# EAGLE schematic fmcboard_v1.61 (EAGLE 9.6.2)

## Sheet 1 of 4: Power, IO, Arduino
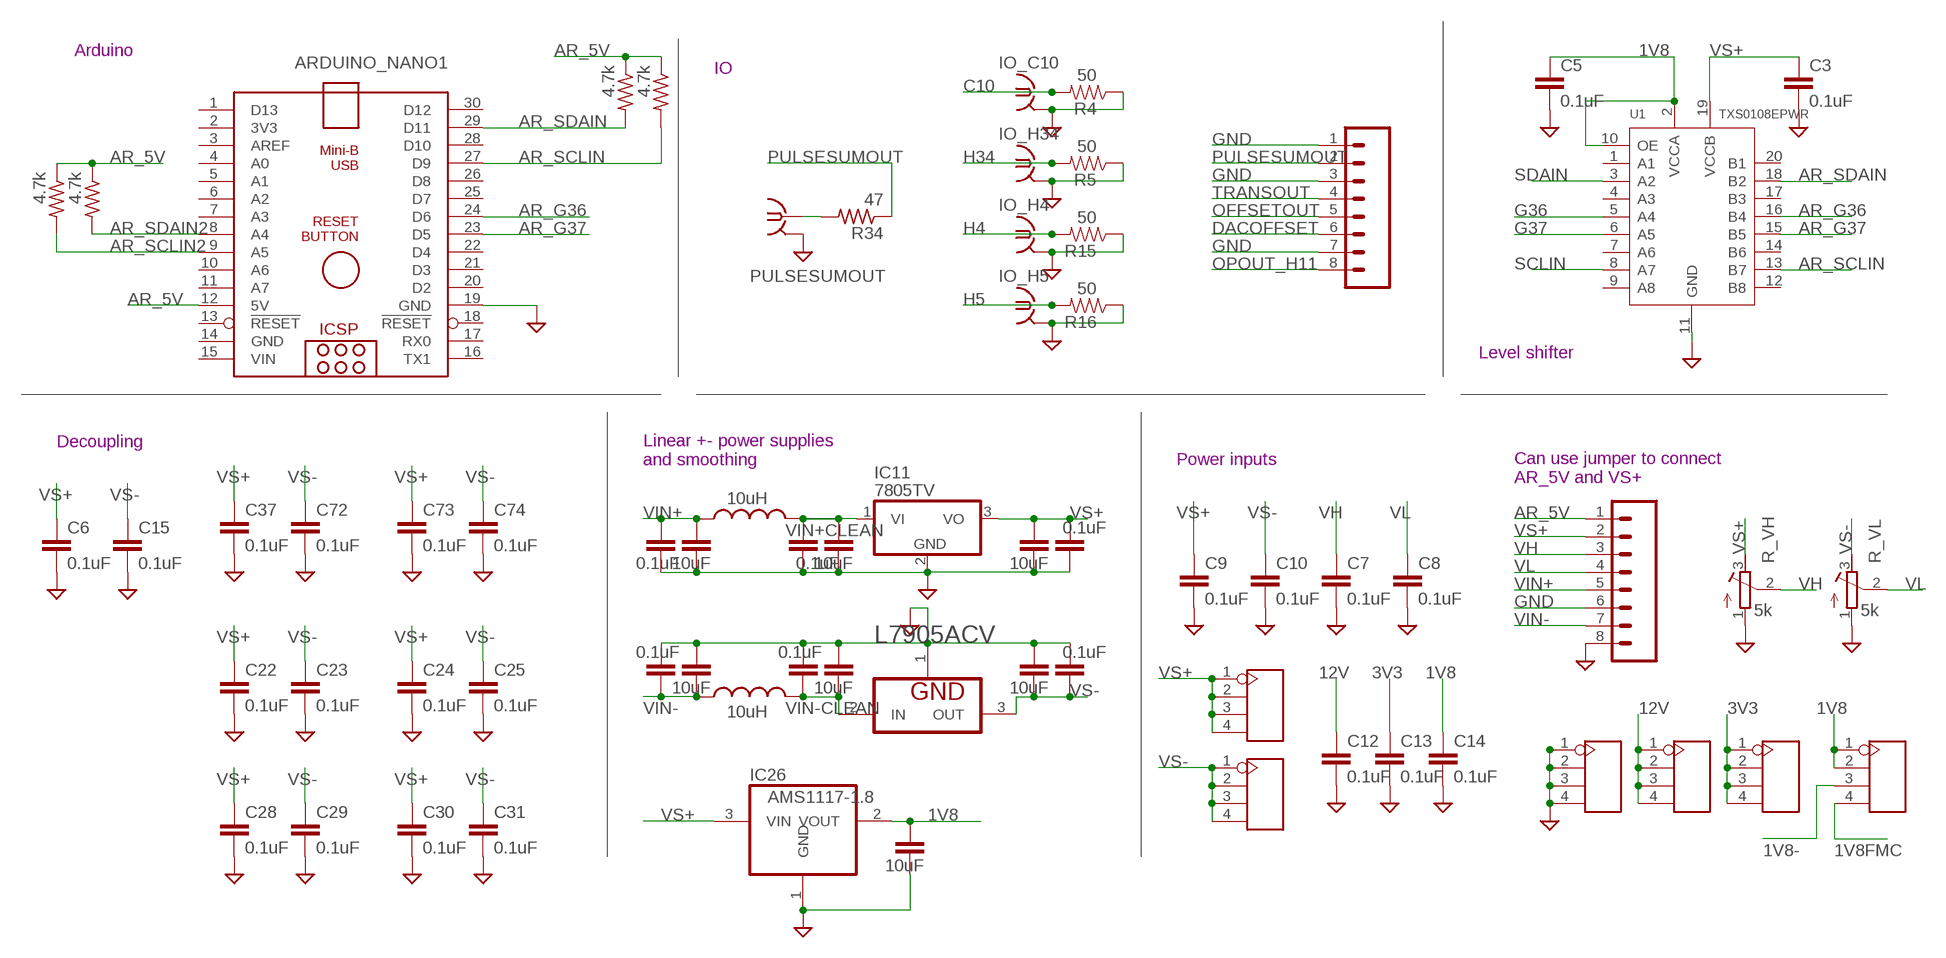
[diagram p0: schematic, sheet 1]

### Parts
ARDUINO_NANO1  1  ARDUINO_NANO  [ARDUINO_NANO]
C1  10uF  CAP0805  [0805]
C2  10uF  CAP0805  [0805]
C3  0.1uF  CAP0805  [0805]
C5  0.1uF  CAP0805  [0805]
C6  0.1uF  CAP0805  [0805]
C7  0.1uF  CAP0805  [0805]
C8  0.1uF  CAP0805  [0805]
C9  0.1uF  CAP0805  [0805]
C10  0.1uF  CAP0805  [0805]
C12  0.1uF  CAP0805  [0805]
C13  0.1uF  CAP0805  [0805]
C14  0.1uF  CAP0805  [0805]
C15  0.1uF  CAP0805  [0805]
C22  0.1uF  CAP0805  [0805]
C23  0.1uF  CAP0805  [0805]
C24  0.1uF  CAP0805  [0805]
C25  0.1uF  CAP0805  [0805]
C28  0.1uF  CAP0805  [0805]
C29  0.1uF  CAP0805  [0805]
C30  0.1uF  CAP0805  [0805]
C31  0.1uF  CAP0805  [0805]
C34  10uF  CAP0805  [0805]
C37  0.1uF  CAP0805  [0805]
C38  10uF  CAP0805  [0805]
C39  10uF  CAP0805  [0805]
C40  10uF  CAP0805  [0805]
C41  10uF  CAP0805  [0805]
C42  0.1uF  CAP0805  [0805]
C43  0.1uF  CAP0805  [0805]
C44  0.1uF  CAP0805  [0805]
C45  0.1uF  CAP0805  [0805]
C46  0.1uF  CAP0805  [0805]
C47  0.1uF  CAP0805  [0805]
C72  0.1uF  CAP0805  [0805]
C73  0.1uF  CAP0805  [0805]
C74  0.1uF  CAP0805  [0805]
IC11  7805TV  [TO220V]
IC26  AMS1117-1.8  REG1117  [SOT223]
IO_C10  BU-SMB-V  [BU-SMB-V]
IO_H4  BU-SMB-V  [BU-SMB-V]
IO_H5  BU-SMB-V  [BU-SMB-V]
IO_H34  BU-SMB-V  [BU-SMB-V]
J1  8pin  CONN_08"  [1X08]
J3  4p-2.54  DIP-BLACK-FEMALE-HEADER-VERT(4P-2.54)  [H4-2.54]
J4  4p-2.54  DIP-BLACK-FEMALE-HEADER-VERT(4P-2.54)  [H4-2.54]
J5  8pin  CONN_08"  [1X08]
J6  4p-2.54  DIP-BLACK-FEMALE-HEADER-VERT(4P-2.54)  [H4-2.54]
J7  4p-2.54  DIP-BLACK-FEMALE-HEADER-VERT(4P-2.54)  [H4-2.54]
J8  4p-2.54  DIP-BLACK-FEMALE-HEADER-VERT(4P-2.54)  [H4-2.54]
J12  4p-2.54  DIP-BLACK-FEMALE-HEADER-VERT(4P-2.54)  [H4-2.54]
L1  10uH  INDUCTOR1210  [1210]
L2  10uH  INDUCTOR1210  [1210]
PULSESUMOUT  BU-SMB-V  [BU-SMB-V]
R4  50  RESISTORAXIAL-0.3  [AXIAL-0.3]
R5  50  RESISTORAXIAL-0.3  [AXIAL-0.3]
R15  50  RESISTORAXIAL-0.3  [AXIAL-0.3]
R16  50  RESISTORAXIAL-0.3  [AXIAL-0.3]
R34  47  R-US_R0805  [R0805]
R48  4.7k  R-US_R0805  [R0805]
R49  4.7k  R-US_R0805  [R0805]
R50  4.7k  R-US_R0805  [R0805]
R51  4.7k  R-US_R0805  [R0805]
R_VH  5k  R-TRIMM3296W  [RTRIM3296W]
R_VL  5k  R-TRIMM3296W  [RTRIM3296W]
U1  TXS0108EPWR  LOGIC-TXS0108EPWR(TSSOP20)  [TSSOP20-0.65-6.5X4.4MM]
U2  STMICROELECTRONICS_L7905ACVSTMICROELECTRONICS_L7905ACV_0_0  [STMICROELECTRONICS_L7905ACV_0]

### Nets
1V8 [power]: C5.1 C14.1 C34.1 IC26.2(VOUT) J12.1 J12.2 U1.2(VCCA) U1.10(OE) ; also sheet 2,3
1V8-: J12.3 ; also sheet 2,3
1V8FMC [power]: J12.4 ; also sheet 4
3V3 [power]: C13.1 J3.1 J3.2 J3.3 J3.4 ; also sheet 4
12V [power]: C12.1 J8.1 J8.2 J8.3 J8.4 ; also sheet 4
AR_5V [power]: ARDUINO_NANO1.12(5V) J1.1 R48.1 R49.1 R50.1 R51.1
AR_G36: ARDUINO_NANO1.24(D6) U1.16(B4)
AR_G37: ARDUINO_NANO1.23(D5) U1.15(B5)
AR_SCLIN: ARDUINO_NANO1.27(D9) R51.2 U1.13(B7)
AR_SCLIN2: ARDUINO_NANO1.9(A5) R49.2 ; also sheet 2
AR_SDAIN: ARDUINO_NANO1.29(D11) R50.2 U1.18(B2)
AR_SDAIN2: ARDUINO_NANO1.8(A4) R48.2 ; also sheet 2
C10: IO_C10.1 R4.P$2 ; also sheet 2,4
DACOFFSET: J5.6 ; also sheet 2,3
G36: U1.5(A4) ; also sheet 4
G37: U1.6(A5) ; also sheet 4
GND [gnd]: ARDUINO_NANO1.19(GND) C1.2 C2.2 C3.2 C5.2 C6.2 C7.2 C8.2 C9.2 C10.2 C12.2 C13.2 C14.2 C15.2 C22.2 C23.2 C24.2 C25.2 C28.2 C29.2 C30.2 C31.2 C34.2 C37.2 C38.2 C39.1 C40.1 C41.1 C42.2 C43.2 C44.1 C45.1 C46.1 C47.2 C72.2 C73.2 C74.2 IC11.2(GND) IC26.1(GND) IO_C10.2 IO_C10.3 IO_C10.4 IO_C10.5 IO_H4.2 IO_H4.3 IO_H4.4 IO_H4.5 IO_H5.2 IO_H5.3 IO_H5.4 IO_H5.5 IO_H34.2 IO_H34.3 IO_H34.4 IO_H34.5 J1.6 J1.8 J4.1 J4.2 J4.3 J4.4 J5.1 J5.3 J5.7 PULSESUMOUT.2 PULSESUMOUT.3 PULSESUMOUT.4 PULSESUMOUT.5 R4.P$1 R5.P$1 R15.P$1 R16.P$1 R_VH.1(A) R_VL.1(A) U1.11(GND) U2.1(GND) ; also sheet 2,3,4
H4: IO_H4.1 R15.P$2 ; also sheet 4
H5: IO_H5.1 R16.P$2 ; also sheet 4
H34: IO_H34.1 R5.P$2 ; also sheet 2,4
N$18: PULSESUMOUT.1 R34.2
OFFSETOUT: J5.5 ; also sheet 3
OPOUT_H11: J5.8 ; also sheet 3,4
PULSESUMOUT: J5.2 R34.1 ; also sheet 3
SCLIN: U1.8(A7) ; also sheet 4
SDAIN: U1.3(A2) ; also sheet 4
TRANSOUT: J5.4 ; also sheet 3
VH: C7.1 J1.3 R_VH.2(S) ; also sheet 3
VIN+ [power]: C1.1 C42.1 J1.5 L1.1
VIN+CLEAN [power]: C2.1 C43.1 IC11.1(VI) L1.2
VIN- [power]: C41.2 C44.2 J1.7 L2.1
VIN-CLEAN [power]: C40.2 C45.2 L2.2 U2.2(IN)
VL: C8.1 J1.4 R_VL.2(S) ; also sheet 3
VS+ [power]: C3.1 C6.1 C9.1 C22.1 C24.1 C28.1 C30.1 C37.1 C38.1 C47.1 C73.1 IC11.3(VO) IC26.3(VIN) J1.2 J6.1 J6.2 J6.3 J6.4 R_VH.3(E) U1.19(VCCB) ; also sheet 2,3
VS- [power]: C10.1 C15.1 C23.1 C25.1 C29.1 C31.1 C39.2 C46.2 C72.1 C74.1 J7.1 J7.2 J7.3 J7.4 R_VL.3(E) U2.3(OUT) ; also sheet 2,3
Unconnected: ARDUINO_NANO1.1(D13) ARDUINO_NANO1.2(3V3) ARDUINO_NANO1.3(AREF) ARDUINO_NANO1.4(A0) ARDUINO_NANO1.5(A1) ARDUINO_NANO1.6(A2) ARDUINO_NANO1.7(A3) ARDUINO_NANO1.10(A6) ARDUINO_NANO1.11(A7) ARDUINO_NANO1.13(!RESET) ARDUINO_NANO1.16(TX1) ARDUINO_NANO1.17(RX0) ARDUINO_NANO1.18(!RESET) ARDUINO_NANO1.20(D2) ARDUINO_NANO1.21(D3) ARDUINO_NANO1.22(D4) ARDUINO_NANO1.25(D7) ARDUINO_NANO1.26(D8) ARDUINO_NANO1.28(D10) ARDUINO_NANO1.30(D12) U1.1(A1) U1.4(A3) U1.7(A6) U1.9(A8) U1.12(B8) U1.14(B6) U1.17(B3) U1.20(B1)

### Notes on the sheet
- Arduino
- IO
- Level shifter
- Decoupling
- Linear +- power supplies
  and smoothing
- Power inputs
- Can use jumper to connect 
  AR_5V and VS+

## Sheet 2 of 4: Pulse generator
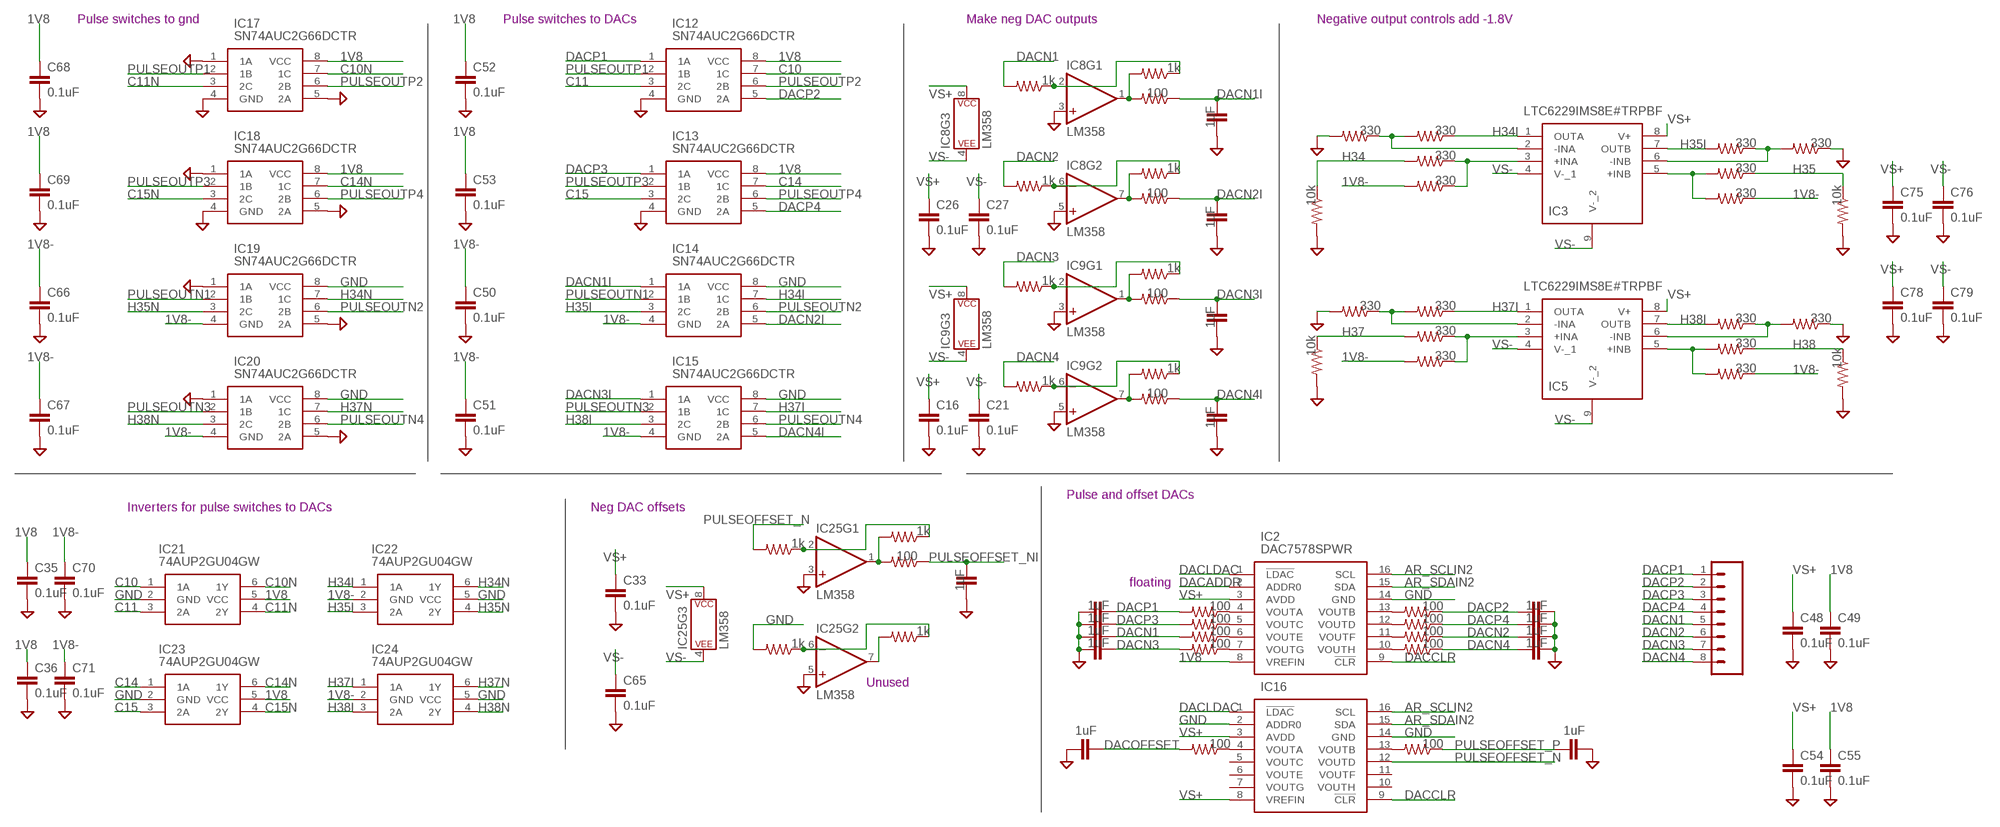
[diagram p1: schematic, sheet 2]

### Parts
C11  1uF  CAP0805  [0805]
C16  0.1uF  CAP0805  [0805]
C17  1uF  CAP0805  [0805]
C18  1uF  CAP0805  [0805]
C19  1uF  CAP0805  [0805]
C20  1uF  CAP0805  [0805]
C21  0.1uF  CAP0805  [0805]
C26  0.1uF  CAP0805  [0805]
C27  0.1uF  CAP0805  [0805]
C33  0.1uF  CAP0805  [0805]
C35  0.1uF  CAP0805  [0805]
C36  0.1uF  CAP0805  [0805]
C48  0.1uF  CAP0805  [0805]
C49  0.1uF  CAP0805  [0805]
C50  0.1uF  CAP0805  [0805]
C51  0.1uF  CAP0805  [0805]
C52  0.1uF  CAP0805  [0805]
C53  0.1uF  CAP0805  [0805]
C54  0.1uF  CAP0805  [0805]
C55  0.1uF  CAP0805  [0805]
C56  1uF  CAP0805  [0805]
C57  1uF  CAP0805  [0805]
C58  1uF  CAP0805  [0805]
C59  1uF  CAP0805  [0805]
C60  1uF  CAP0805  [0805]
C61  1uF  CAP0805  [0805]
C62  1uF  CAP0805  [0805]
C63  1uF  CAP0805  [0805]
C64  1uF  CAP0805  [0805]
C65  0.1uF  CAP0805  [0805]
C66  0.1uF  CAP0805  [0805]
C67  0.1uF  CAP0805  [0805]
C68  0.1uF  CAP0805  [0805]
C69  0.1uF  CAP0805  [0805]
C70  0.1uF  CAP0805  [0805]
C71  0.1uF  CAP0805  [0805]
C75  0.1uF  CAP0805  [0805]
C76  0.1uF  CAP0805  [0805]
C78  0.1uF  CAP0805  [0805]
C79  0.1uF  CAP0805  [0805]
C80  1uF  CAP0805  [0805]
IC2  DAC7578SPWR  [SOP65P640X120-16N]
IC3  LTC6229IMS8E#TRPBF  [SOP65P490X110-9N]
IC5  LTC6229IMS8E#TRPBF  [SOP65P490X110-9N]
IC8  LM358  OPAMP-DUALU  [SO08]
IC9  LM358  OPAMP-DUALU  [SO08]
IC12  SN74AUC2G66DCTR  [SOP65P400X130-8N]
IC13  SN74AUC2G66DCTR  [SOP65P400X130-8N]
IC14  SN74AUC2G66DCTR  [SOP65P400X130-8N]
IC15  SN74AUC2G66DCTR  [SOP65P400X130-8N]
IC16  DAC7578SPWR  [SOP65P640X120-16N]
IC17  SN74AUC2G66DCTR  [SOP65P400X130-8N]
IC18  SN74AUC2G66DCTR  [SOP65P400X130-8N]
IC19  SN74AUC2G66DCTR  [SOP65P400X130-8N]
IC20  SN74AUC2G66DCTR  [SOP65P400X130-8N]
IC21  74AUP2GU04GW  74AUP2GU04GW,125  [SOT65P210X110-6N]
IC22  74AUP2GU04GW  74AUP2GU04GW,125  [SOT65P210X110-6N]
IC23  74AUP2GU04GW  74AUP2GU04GW,125  [SOT65P210X110-6N]
IC24  74AUP2GU04GW  74AUP2GU04GW,125  [SOT65P210X110-6N]
IC25  LM358  OPAMP-DUALU  [SO08]
J9  8pin  CONN_08"  [1X08]
R14  1k  R-US_R0805  [R0805]
R21  330  R-US_R0805  [R0805]
R22  330  R-US_R0805  [R0805]
R23  330  R-US_R0805  [R0805]
R24  330  R-US_R0805  [R0805]
R27  330  R-US_R0805  [R0805]
R28  330  R-US_R0805  [R0805]
R29  330  R-US_R0805  [R0805]
R30  330  R-US_R0805  [R0805]
R35  1k  R-US_R0805  [R0805]
R37  330  R-US_R0805  [R0805]
R39  330  R-US_R0805  [R0805]
R41  330  R-US_R0805  [R0805]
R43  330  R-US_R0805  [R0805]
R44  330  R-US_R0805  [R0805]
R45  330  R-US_R0805  [R0805]
R46  330  R-US_R0805  [R0805]
R47  100  R-US_R0805  [R0805]
R52  330  R-US_R0805  [R0805]
R53  100  R-US_R0805  [R0805]
R54  100  R-US_R0805  [R0805]
R55  100  R-US_R0805  [R0805]
R56  100  R-US_R0805  [R0805]
R57  100  R-US_R0805  [R0805]
R58  100  R-US_R0805  [R0805]
R59  100  R-US_R0805  [R0805]
R60  100  R-US_R0805  [R0805]
R61  1k  R-US_R0805  [R0805]
R62  1k  R-US_R0805  [R0805]
R63  1k  R-US_R0805  [R0805]
R64  1k  R-US_R0805  [R0805]
R65  1k  R-US_R0805  [R0805]
R66  1k  R-US_R0805  [R0805]
R67  1k  R-US_R0805  [R0805]
R68  1k  R-US_R0805  [R0805]
R69  1k  R-US_R0805  [R0805]
R70  1k  R-US_R0805  [R0805]
R73  100  R-US_R0805  [R0805]
R74  100  R-US_R0805  [R0805]
R75  100  R-US_R0805  [R0805]
R76  100  R-US_R0805  [R0805]
R77  100  R-US_R0805  [R0805]
R80  10k  R-US_R0805  [R0805]
R81  10k  R-US_R0805  [R0805]
R82  10k  R-US_R0805  [R0805]
R83  10k  R-US_R0805  [R0805]
R84  100  R-US_R0805  [R0805]

### Nets
1V8 [power]: C35.1 C36.1 C49.1 C52.1 C53.1 C55.1 C68.1 C69.1 IC2.8(VREFIN) IC12.8(VCC) IC13.8(VCC) IC17.8(VCC) IC18.8(VCC) IC21.5(VCC) IC23.5(VCC) ; also sheet 1,3
1V8-: C50.1 C51.1 C66.1 C67.1 C70.1 C71.1 IC14.4(GND) IC15.4(GND) IC19.4(GND) IC20.4(GND) IC22.2(GND) IC24.2(GND) R22.2 R28.1 R39.2 R45.1 ; also sheet 1,3
AR_SCLIN2: IC2.16(SCL) IC16.16(SCL) ; also sheet 1
AR_SDAIN2: IC2.15(SDA) IC16.15(SDA) ; also sheet 1
C10: IC12.7(1C) IC21.1(1A) ; also sheet 1,4
C10N: IC17.7(1C) IC21.6(1Y)
C11: IC12.3(2C) IC21.3(2A) ; also sheet 4
C11N: IC17.3(2C) IC21.4(2Y)
C14: IC13.7(1C) IC23.1(1A) ; also sheet 4
C14N: IC18.7(1C) IC23.6(1Y)
C15: IC13.3(2C) IC23.3(2A) ; also sheet 4
C15N: IC18.3(2C) IC23.4(2Y)
DACADDR: IC2.2(ADDR0)
DACCLR: IC2.9(!CLR) IC16.9(!CLR)
DACLDAC: IC2.1(!LDAC) IC16.1(!LDAC)
DACN1: C57.2 J9.5 R54.2 R64.2
DACN1I: C17.2 IC14.1(1A) R74.1
DACN2: C61.1 J9.6 R58.1 R65.2
DACN2I: C18.2 IC14.5(2A) R75.1
DACN3: C56.2 J9.7 R55.2 R68.2
DACN3I: C19.2 IC15.1(1A) R76.1
DACN4: C60.1 J9.8 R59.1 R69.2
DACN4I: C20.2 IC15.5(2A) R77.1
DACOFFSET: C64.2 R60.2 ; also sheet 1,3
DACP1: C59.2 IC12.1(1A) J9.1 R47.2
DACP2: C63.1 IC12.5(2A) J9.2 R56.1
DACP3: C58.2 IC13.1(1A) J9.3 R53.2
DACP4: C62.1 IC13.5(2A) J9.4 R57.1
GND [gnd]: C11.1 C16.2 C17.1 C18.1 C19.1 C20.1 C21.2 C26.2 C27.2 C33.2 C35.2 C36.2 C48.2 C49.2 C50.2 C51.2 C52.2 C53.2 C54.2 C55.2 C56.1 C57.1 C58.1 C59.1 C60.2 C61.2 C62.2 C63.2 C64.1 C65.2 C66.2 C67.2 C68.2 C69.2 C70.2 C71.2 C75.2 C76.2 C78.2 C79.2 C80.2 IC2.14(GND) IC8.3(+IN) IC8.5(+IN) IC9.3(+IN) IC9.5(+IN) IC12.4(GND) IC13.4(GND) IC14.8(VCC) IC15.8(VCC) IC16.2(ADDR0) IC16.14(GND) IC17.1(1A) IC17.4(GND) IC17.5(2A) IC18.1(1A) IC18.4(GND) IC18.5(2A) IC19.1(1A) IC19.5(2A) IC19.8(VCC) IC20.1(1A) IC20.5(2A) IC20.8(VCC) IC21.2(GND) IC22.5(VCC) IC23.2(GND) IC24.5(VCC) IC25.3(+IN) IC25.5(+IN) R24.2 R30.1 R43.2 R52.1 R70.2 R80.2 R81.2 R82.2 R83.2 ; also sheet 1,3,4
H34: R21.2 R80.1 ; also sheet 1,4
H34I: IC3.1(OUTA) IC14.7(1C) IC22.1(1A) R23.1
H34N: IC19.7(1C) IC22.6(1Y)
H35: R27.1 R81.1 ; also sheet 4
H35I: IC3.7(OUTB) IC14.3(2C) IC22.3(2A) R29.2
H35N: IC19.3(2C) IC22.4(2Y)
H37: R37.2 R83.1 ; also sheet 4
H37I: IC5.1(OUTA) IC15.7(1C) IC24.1(1A) R41.1
H37N: IC20.7(1C) IC24.6(1Y)
H38: R44.1 R82.1 ; also sheet 4
H38I: IC5.7(OUTB) IC15.3(2C) IC24.3(2A) R46.2
H38N: IC20.3(2C) IC24.4(2Y)
N$4: IC3.6(-INB) R29.1 R30.2
N$5: IC3.5(+INB) R27.2 R28.2
N$6: IC5.2(-INA) R41.2 R43.1
N$7: IC3.3(+INA) R21.1 R22.1
N$12: IC5.6(-INB) R46.1 R52.2
N$13: IC3.2(-INA) R23.2 R24.1
N$14: IC5.3(+INA) R37.1 R39.1
N$15: IC5.5(+INB) R44.2 R45.2
N$16: IC8.7(OUT) R62.2 R75.2
N$17: IC8.1(OUT) R63.2 R74.2
N$19: IC8.2(-IN) R63.1 R64.1
N$20: IC8.6(-IN) R62.1 R65.1
N$21: IC2.13(VOUTB) R56.2
N$22: IC2.4(VOUTA) R47.1
N$23: IC2.5(VOUTC) R53.1
N$24: IC2.6(VOUTE) R54.1
N$25: IC2.7(VOUTG) R55.1
N$26: IC2.12(VOUTD) R57.2
N$27: IC2.11(VOUTF) R58.2
N$28: IC2.10(VOUTH) R59.2
N$29: IC16.4(VOUTA) R60.1
N$30: IC25.7(OUT) R14.2
N$31: IC9.7(OUT) R66.2 R77.2
N$32: IC9.1(OUT) R67.2 R76.2
N$33: IC9.2(-IN) R67.1 R68.1
N$34: IC9.6(-IN) R66.1 R69.1
N$36: IC25.1(OUT) R35.2 R73.2
N$37: IC25.2(-IN) R35.1 R61.1
N$38: IC25.6(-IN) R14.1 R70.1
N$39: IC16.13(VOUTB) R84.2
PULSEOFFSET_N: IC16.12(VOUTD) R61.2
PULSEOFFSET_NI: C11.2 R73.1 ; also sheet 3
PULSEOFFSET_P: C80.1 R84.1 ; also sheet 3
PULSEOUTN1: IC14.2(1B) IC19.2(1B) ; also sheet 3
PULSEOUTN2: IC14.6(2B) IC19.6(2B) ; also sheet 3
PULSEOUTN3: IC15.2(1B) IC20.2(1B) ; also sheet 3
PULSEOUTN4: IC15.6(2B) IC20.6(2B) ; also sheet 3
PULSEOUTP1: IC12.2(1B) IC17.2(1B) ; also sheet 3
PULSEOUTP2: IC12.6(2B) IC17.6(2B) ; also sheet 3
PULSEOUTP3: IC13.2(1B) IC18.2(1B) ; also sheet 3
PULSEOUTP4: IC13.6(2B) IC18.6(2B) ; also sheet 3
VS+ [power]: C16.1 C26.1 C33.1 C48.1 C54.1 C75.1 C78.1 IC2.3(AVDD) IC3.8(V+) IC5.8(V+) IC8.8(P$V+) IC9.8(P$V+) IC16.3(AVDD) IC16.8(VREFIN) IC25.8(P$V+) ; also sheet 1,3
VS- [power]: C21.1 C27.1 C65.1 C76.1 C79.1 IC3.4(V-_1) IC3.9(V-_2) IC5.4(V-_1) IC5.9(V-_2) IC8.4(P$V-) IC9.4(P$V-) IC25.4(P$V-) ; also sheet 1,3
Unconnected: IC16.5(VOUTC) IC16.6(VOUTE) IC16.7(VOUTG) IC16.10(VOUTH) IC16.11(VOUTF)

### Notes on the sheet
- Pulse switches to gnd | Pulse switches to DACs | Make neg DAC outputs | Negative output controls add -1.8V
- Pulse and offset DACs
- Inverters for pulse switches to DACs | Neg DAC offsets
- floating
- Unused

## Sheet 3 of 4: Input amplifiers
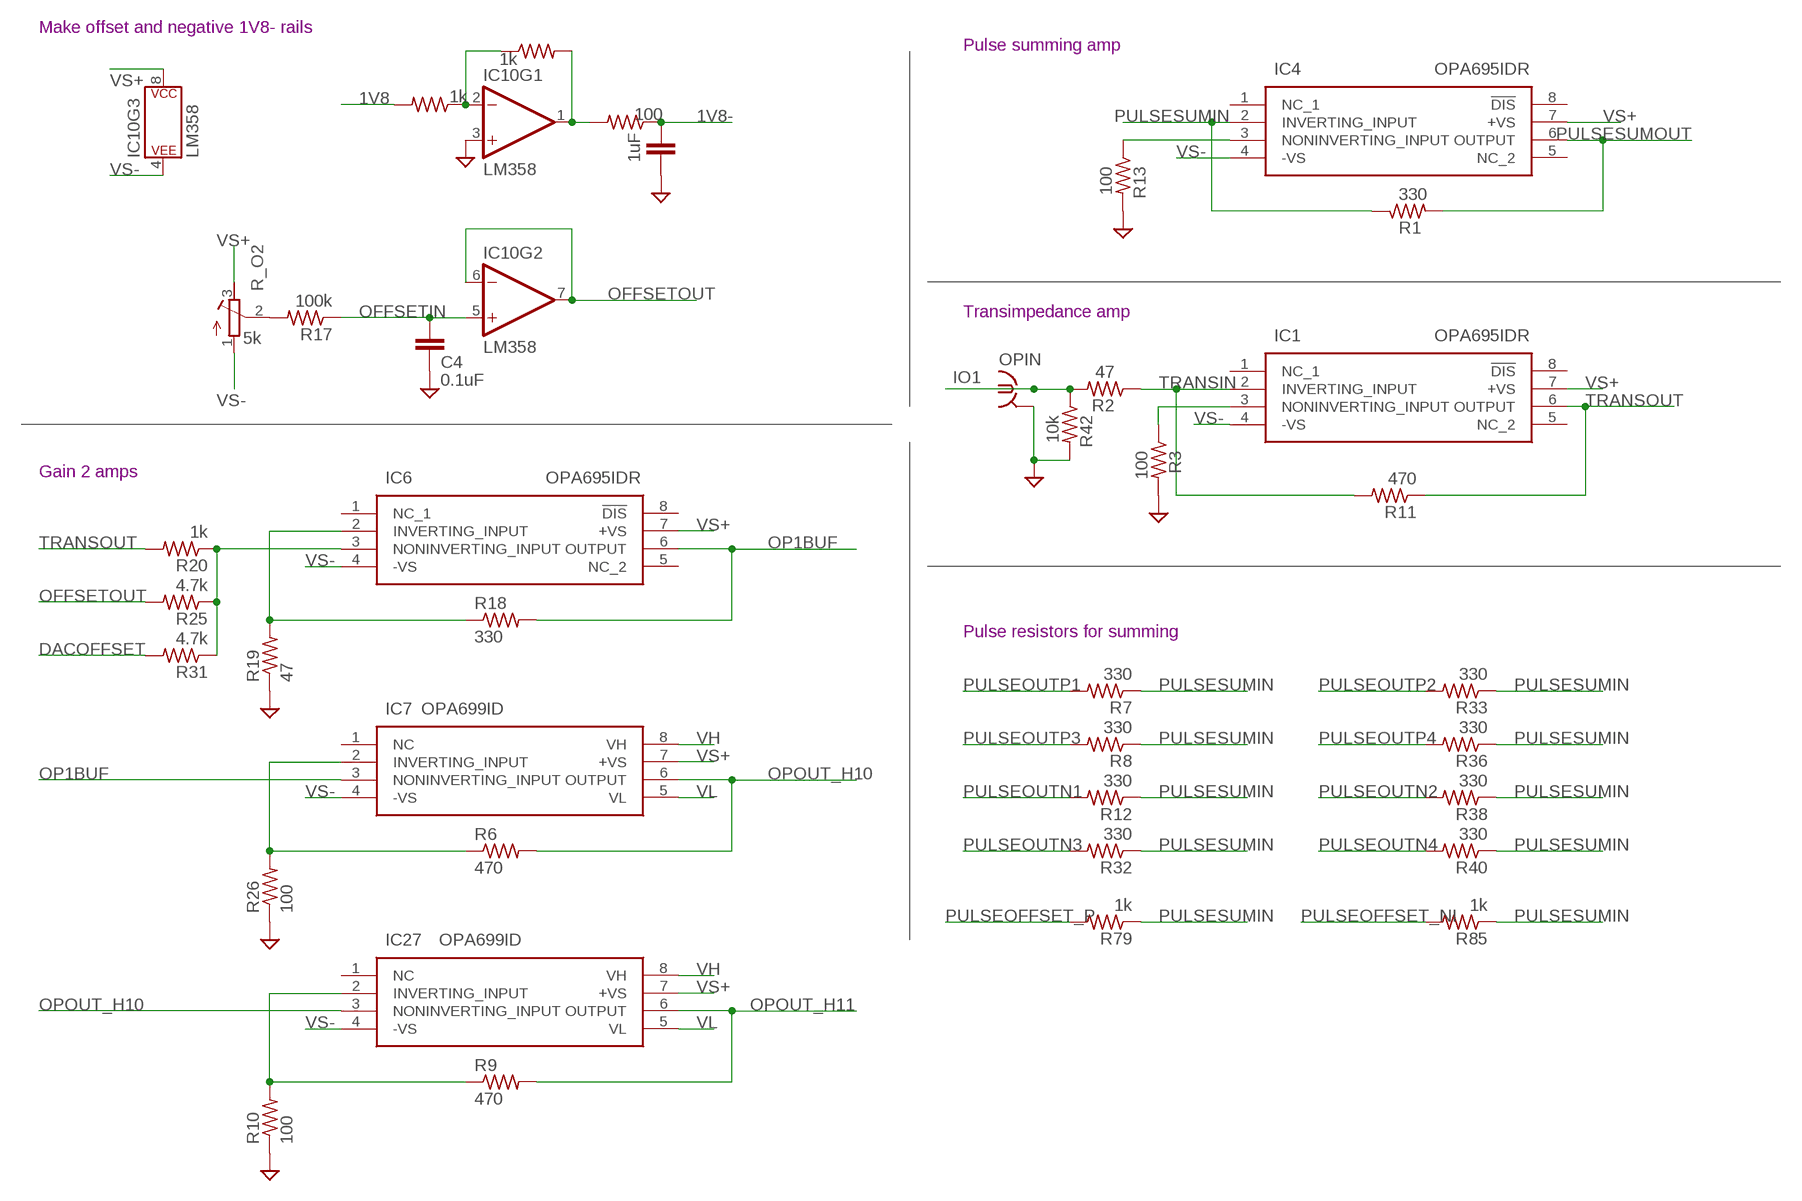
[diagram p2: schematic, sheet 3]

### Parts
C4  0.1uF  CAP0805  [0805]
C77  1uF  CAP0805  [0805]
IC1  OPA695IDR  [SOIC127P600X175-8N]
IC4  OPA695IDR  [SOIC127P600X175-8N]
IC6  OPA695IDR  [SOIC127P600X175-8N]
IC7  OPA699ID  [SOIC127P600X175-8N]
IC10  LM358  OPAMP-DUALU  [SO08]
IC27  OPA699ID  [SOIC127P600X175-8N]
OPIN  BU-SMB-V  [BU-SMB-V]
R1  330  R-US_R0805  [R0805]
R2  47  R-US_R0805  [R0805]
R3  100  R-US_R0805  [R0805]
R6  470  R-US_R0805  [R0805]
R7  330  R-US_R0805  [R0805]
R8  330  R-US_R0805  [R0805]
R9  470  R-US_R0805  [R0805]
R10  100  R-US_R0805  [R0805]
R11  470  R-US_R0805  [R0805]
R12  330  R-US_R0805  [R0805]
R13  100  R-US_R0805  [R0805]
R17  100k  R-US_R0805  [R0805]
R18  330  R-US_R0805  [R0805]
R19  47  R-US_R0805  [R0805]
R20  1k  R-US_R0805  [R0805]
R25  4.7k  R-US_R0805  [R0805]
R26  100  R-US_R0805  [R0805]
R31  4.7k  R-US_R0805  [R0805]
R32  330  R-US_R0805  [R0805]
R33  330  R-US_R0805  [R0805]
R36  330  R-US_R0805  [R0805]
R38  330  R-US_R0805  [R0805]
R40  330  R-US_R0805  [R0805]
R42  10k  R-US_R0805  [R0805]
R71  1k  R-US_R0805  [R0805]
R72  1k  R-US_R0805  [R0805]
R78  100  R-US_R0805  [R0805]
R79  1k  R-US_R0805  [R0805]
R85  1k  R-US_R0805  [R0805]
R_O2  5k  R-TRIMM3296W  [RTRIM3296W]

### Nets
1V8 [power]: R72.2 ; also sheet 1,2
1V8-: C77.2 R78.1 ; also sheet 1,2
$N99: IC10.2(-IN) R71.1 R72.1
DACOFFSET: R31.2 ; also sheet 1,2
GND [gnd]: C4.2 C77.1 IC10.3(+IN) OPIN.2 OPIN.3 OPIN.4 OPIN.5 R3.2 R10.1 R13.2 R19.1 R26.1 R42.2 ; also sheet 1,2,4
IO1: OPIN.1 R2.2 R42.1
N$1: IC27.2(INVERTING_INPUT) R9.1 R10.2
N$2: R17.2 R_O2.2(S)
N$3 [gnd]: IC1.3(NONINVERTING_INPUT) R3.1
N$8 [gnd]: IC4.3(NONINVERTING_INPUT) R13.1
N$9: IC6.2(INVERTING_INPUT) R18.1 R19.2
N$10: IC6.3(NONINVERTING_INPUT) R20.1 R25.1 R31.1
N$11: IC7.2(INVERTING_INPUT) R6.1 R26.2
N$35: IC10.1(OUT) R71.2 R78.2
OFFSETIN: C4.1 IC10.5(+IN) R17.1
OFFSETOUT: IC10.6(-IN) IC10.7(OUT) R25.2 ; also sheet 1
OP1BUF: IC6.6(OUTPUT) IC7.3(NONINVERTING_INPUT) R18.2
OPOUT_H10: IC7.6(OUTPUT) IC27.3(NONINVERTING_INPUT) R6.2 ; also sheet 4
OPOUT_H11: IC27.6(OUTPUT) R9.2 ; also sheet 1,4
PULSEOFFSET_NI: R85.2 ; also sheet 2
PULSEOFFSET_P: R79.2 ; also sheet 2
PULSEOUTN1: R12.2 ; also sheet 2
PULSEOUTN2: R38.2 ; also sheet 2
PULSEOUTN3: R32.2 ; also sheet 2
PULSEOUTN4: R40.2 ; also sheet 2
PULSEOUTP1: R7.2 ; also sheet 2
PULSEOUTP2: R33.2 ; also sheet 2
PULSEOUTP3: R8.2 ; also sheet 2
PULSEOUTP4: R36.2 ; also sheet 2
PULSESUMIN: IC4.2(INVERTING_INPUT) R1.1 R7.1 R8.1 R12.1 R32.1 R33.1 R36.1 R38.1 R40.1 R79.1 R85.1
PULSESUMOUT: IC4.6(OUTPUT) R1.2 ; also sheet 1
TRANSIN: IC1.2(INVERTING_INPUT) R2.1 R11.2
TRANSOUT: IC1.6(OUTPUT) R11.1 R20.2 ; also sheet 1
VH: IC7.8(VH) IC27.8(VH) ; also sheet 1
VL: IC7.5(VL) IC27.5(VL) ; also sheet 1
VS+ [power]: IC1.7(+VS) IC4.7(+VS) IC6.7(+VS) IC7.7(+VS) IC10.8(P$V+) IC27.7(+VS) R_O2.3(E) ; also sheet 1,2
VS- [power]: IC1.4(-VS) IC4.4(-VS) IC6.4(-VS) IC7.4(-VS) IC10.4(P$V-) IC27.4(-VS) R_O2.1(A) ; also sheet 1,2
Unconnected: IC1.1(NC_1) IC1.5(NC_2) IC1.8(!DIS) IC4.1(NC_1) IC4.5(NC_2) IC4.8(!DIS) IC6.1(NC_1) IC6.5(NC_2) IC6.8(!DIS) IC7.1(NC) IC27.1(NC)

### Notes on the sheet
- Make offset and negative 1V8- rails
- Pulse summing amp
- Transimpedance amp
- Gain 2 amps
- Pulse resistors for summing

## Sheet 4 of 4: FMC connections
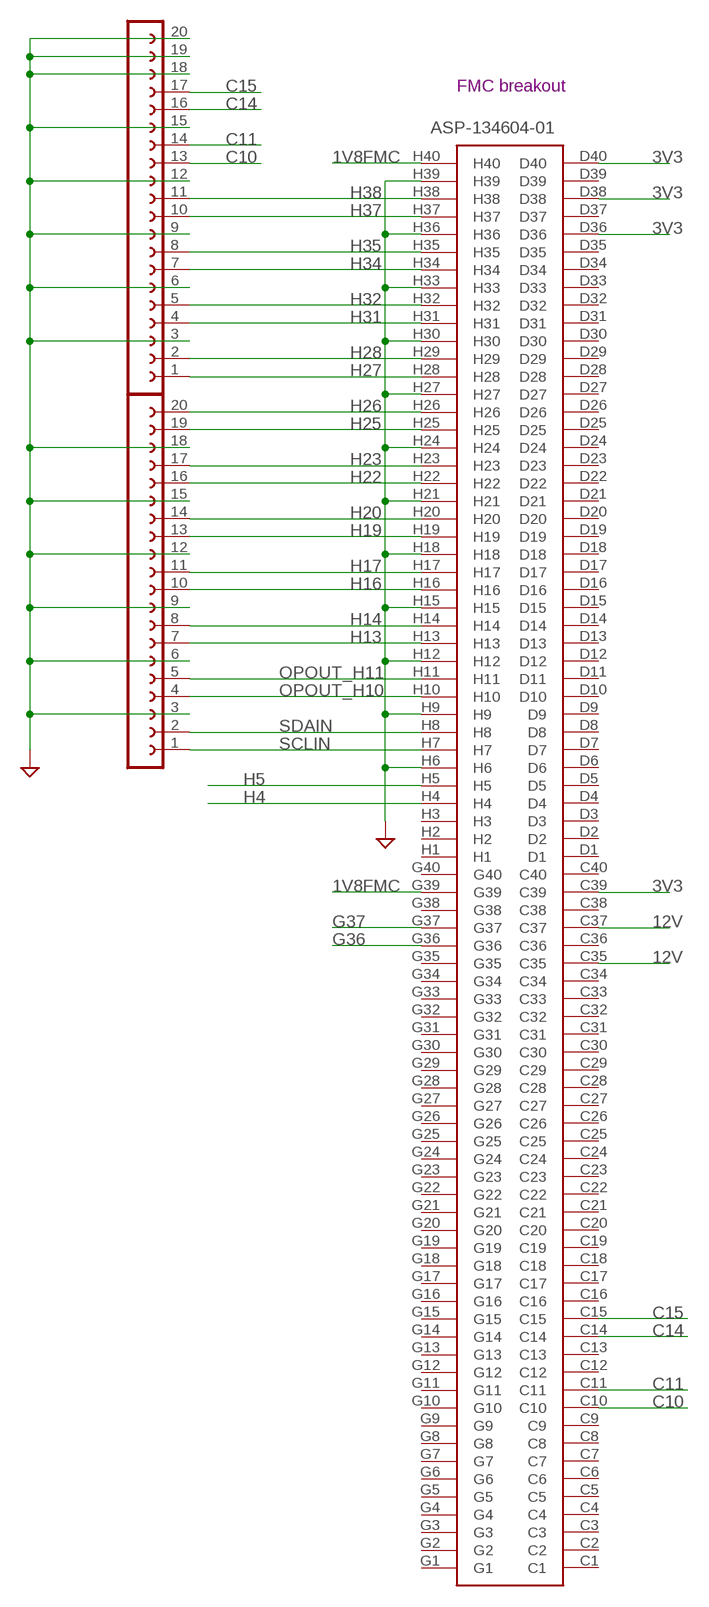
[diagram p3: schematic, sheet 4]

### Parts
J2  ASP-134604-01  [ASP13460401]
SV1  20  FE20-1  [FE20]
SV2  20  FE20-1  [FE20]

### Nets
1V8FMC [power]: J2.G39 J2.H40 ; also sheet 1
3V3 [power]: J2.C39 J2.D36 J2.D38 J2.D40 ; also sheet 1
12V [power]: J2.C35 J2.C37 ; also sheet 1
C10: J2.C10 SV2.13 ; also sheet 1,2
C11: J2.C11 SV2.14 ; also sheet 2
C14: J2.C14 SV2.16 ; also sheet 2
C15: J2.C15 SV2.17 ; also sheet 2
G36: J2.G36 ; also sheet 1
G37: J2.G37 ; also sheet 1
GND [gnd]: J2.H6 J2.H9 J2.H12 J2.H15 J2.H18 J2.H21 J2.H24 J2.H27 J2.H30 J2.H33 J2.H36 J2.H39 SV1.3 SV1.6 SV1.9 SV1.12 SV1.15 SV1.18 SV2.3 SV2.6 SV2.9 SV2.12 SV2.15 SV2.18 SV2.19 SV2.20 ; also sheet 1,2,3
H4: J2.H4 ; also sheet 1
H5: J2.H5 ; also sheet 1
H13: J2.H13 SV1.7
H14: J2.H14 SV1.8
H16: J2.H16 SV1.10
H17: J2.H17 SV1.11
H19: J2.H19 SV1.13
H20: J2.H20 SV1.14
H22: J2.H22 SV1.16
H23: J2.H23 SV1.17
H25: J2.H25 SV1.19
H26: J2.H26 SV1.20
H27: J2.H28 SV2.1
H28: J2.H29 SV2.2
H31: J2.H31 SV2.4
H32: J2.H32 SV2.5
H34: J2.H34 SV2.7 ; also sheet 1,2
H35: J2.H35 SV2.8 ; also sheet 2
H37: J2.H37 SV2.10 ; also sheet 2
H38: J2.H38 SV2.11 ; also sheet 2
OPOUT_H10: J2.H10 SV1.4 ; also sheet 3
OPOUT_H11: J2.H11 SV1.5 ; also sheet 1,3
SCLIN: J2.H7 SV1.1 ; also sheet 1
SDAIN: J2.H8 SV1.2 ; also sheet 1
Unconnected: J2.C1 J2.C2 J2.C3 J2.C4 J2.C5 J2.C6 J2.C7 J2.C8 J2.C9 J2.C12 J2.C13 J2.C16 J2.C17 J2.C18 J2.C19 J2.C20 J2.C21 J2.C22 J2.C23 J2.C24 J2.C25 J2.C26 J2.C27 J2.C28 J2.C29 J2.C30 J2.C31 J2.C32 J2.C33 J2.C34 J2.C36 J2.C38 J2.C40 J2.D1 J2.D2 J2.D3 J2.D4 J2.D5 J2.D6 J2.D7 J2.D8 J2.D9 J2.D10 J2.D11 J2.D12 J2.D13 J2.D14 J2.D15 J2.D16 J2.D17 J2.D18 J2.D19 J2.D20 J2.D21 J2.D22 J2.D23 J2.D24 J2.D25 J2.D26 J2.D27 J2.D28 J2.D29 J2.D30 J2.D31 J2.D32 J2.D33 J2.D34 J2.D35 J2.D37 J2.D39 J2.G1 J2.G2 J2.G3 J2.G4 J2.G5 J2.G6 J2.G7 J2.G8 J2.G9 J2.G10 J2.G11 J2.G12 J2.G13 J2.G14 J2.G15 J2.G16 J2.G17 J2.G18 J2.G19 J2.G20 J2.G21 J2.G22 J2.G23 J2.G24 J2.G25 J2.G26 J2.G27 J2.G28 J2.G29 J2.G30 J2.G31 J2.G32 J2.G33 J2.G34 J2.G35 J2.G38 J2.G40 J2.H1 J2.H2 J2.H3

### Notes on the sheet
- FMC breakout

## Power pins joined to a net without a drawn wire
GND: ARDUINO_NANO1.14(GND)
VIN: ARDUINO_NANO1.15(VIN)

## Library data of the parts
ARDUINO_NANO1 = ArduinoNanoV30:ARDUINO_NANO: Arduino Nano V3.0 Overview: The Arduino Nano is a small, complete, and breadboard-friendly board based on the ATmega328 (Arduino Nano 3.x) or ATmega168 (Arduino Nano 2.x). It has more or less the same functionality of the Arduino Duemilanove, but in a different package. It lacks only a DC power jack, and works with a Mini-B USB cable instead of a standard one. The Nano was designed and is being produced by Gravitech. Specifications: Microcontroller Atmel ATmega168 or ATmega328 Operating Voltage (logic level) 5 V Input Voltage (recommended) 7-12 V Input Voltage (limits) 6-20 V Digital I/O Pins 14 (of which 6 provide PWM output) Analog Input Pins 8 DC Current per I/O Pin 40 mA Flash Memory 16 KB (ATmega168) or 32 KB (ATmega328) of which 2 KB used by bootloader SRAM 1 KB (ATmega168) or 2 KB (ATmega328) EEPROM 512 bytes (ATmega168) or 1 KB (ATmega328) Clock Speed 16 MHz Dimensions 0.73" x 1.70" Length 45 mm Width 18 mm Weigth 5 g Power: The Arduino Nano can be powered via the Mini-B USB connection, 6-20V unregulated external power supply (pin 30), or 5V regulated external power supply (pin 27). The power source is automatically selected to the highest voltage source. Memory: The ATmega168 has 16 KB of flash memory for storing code (of which 2 KB is used for the bootloader); the ATmega328 has 32 KB, (also with 2 KB used for the bootloader). The ATmega168 has 1 KB of SRAM and 512 bytes of EEPROM (which can be read and written with the EEPROM library); the ATmega328 has 2 KB of SRAM and 1 KB of EEPROM. Input and Output: Each of the 14 digital pins on the Nano can be used as an input or output, using pinMode(), digitalWrite(), and digitalRead() functions. They operate at 5 volts. Each pin can provide or receive a maximum of 40 mA and has an internal pull-up resistor (disconnected by default) of 20-50 kOhms. In addition, some pins have specialized functions. Visit Arduino - ArduinoBoardNano <https://www.arduino.cc/en/Main/ArduinoBoardNano>
C1-C31 C33-C80 = SparkFun-Passives:CAP: Capacitor Standard 0603 ceramic capacitor, and 0.1" leaded capacitor.
IC1 IC4 IC6 = OPA695IDR:OPA695IDR: High Speed Operational Amplifiers Ultra-Wideband Curre nt Feedback Source: Datasheet <https://www.ti.com/lit/ds/symlink/opa695.pdf?HQS=dis-dk-null-digikeymode-dsf-pf-null-wwe&ts=1639563683279&ref_url=https%3A%2F%2Fwww.ti.com%2Fgeneral%2Fdocs%2Fsuppproductinfo.tsp%3FdistId%3D10%26gotoUrl%3Dhttps%3A%2F%2Fwww.ti.com%>; DESCRIPTION: High Speed Operational Amplifiers Ultra-Wideband Curre nt Feedback; HEIGHT: 1.75mm; MANUFACTURER_NAME: Texas Instruments; MANUFACTURER_PART_NUMBER: OPA695IDR; MOUSER_PART_NUMBER: 595-OPA695IDR; MOUSER_PRICE-STOCK: https://www.mouser.co.uk/ProductDetail/Texas-Instruments/OPA695IDR?qs=wgAEGBTxy7loIslyoQGyeQ%3D%3D
IC2 IC16 = DAC7578SPWR:DAC7578SPWR: 12-bit, Octal Channel, Ultra-Low Glitch, Voltage Output, 2-Wire Interface DAC Source: Datasheet <http://www.ti.com/lit/gpn/DAC7578>; DESCRIPTION: 12-bit, Octal Channel, Ultra-Low Glitch, Voltage Output, 2-Wire Interface DAC; HEIGHT: 1.2mm; MANUFACTURER_NAME: Texas Instruments; MANUFACTURER_PART_NUMBER: DAC7578SPWR; MOUSER_PART_NUMBER: 595-DAC7578SPWR; MOUSER_PRICE-STOCK: https://www.mouser.co.uk/ProductDetail/Texas-Instruments/DAC7578SPWR?qs=EuM%2FBx4ov4Q5WBxZ%252BdwNrg%3D%3D
IC3 IC5 = LTC6229IMS8E#TRPBF:LTC6229IMS8E#TRPBF: High Speed Operational Amplifiers Prec, Low Drift & Noise Hi Speed Amp Source: Datasheet <https://www.analog.com/media/en/technical-documentation/data-sheets/LTC6228-6229.pdf>; DESCRIPTION: High Speed Operational Amplifiers Prec, Low Drift & Noise Hi Speed Amp; HEIGHT: 1.1mm; MANUFACTURER_NAME: Analog Devices; MANUFACTURER_PART_NUMBER: LTC6229IMS8E#TRPBF; MOUSER_PART_NUMBER: 584-LTC6229IMS8E#TR; MOUSER_PRICE-STOCK: https://www.mouser.co.uk/ProductDetail/Analog-Devices/LTC6229IMS8ETRPBF?qs=BJlw7L4Cy7%252B3qToO7Cz9NQ%3D%3D
IC7 IC27 = OPA699ID:OPA699ID: Texas Instruments OPA699ID Op Amp, 880MHz, 9 V, 8-Pin SOIC Source: Datasheet <http://www.ti.com/lit/gpn/opa699>; DESCRIPTION: Texas Instruments OPA699ID Op Amp, 880MHz, 9 V, 8-Pin SOIC; HEIGHT: 1.75mm; MANUFACTURER_NAME: Texas Instruments; MANUFACTURER_PART_NUMBER: OPA699ID; MOUSER_PART_NUMBER: 595-OPA699ID; MOUSER_PRICE-STOCK: https://www.mouser.co.uk/ProductDetail/Texas-Instruments/OPA699ID?qs=wgAEGBTxy7n0Nk%252BpyQzyiA%3D%3D
IC8-IC10 IC25 = SparkFun-IC-Amplifiers:OPAMP-DUAL: Generic op-amp footprint This component is for the standard 358 pinning of a dual op-amp From the LM358 datasheet: Pin 1: Output A Pin 2: Inverting Input A Pin 3: Non-Inverting Input A Pin 4: Gnd Pin 5: Non-Inverting Input B Pin 6: Inverting Input B Pin 7: Output B Pin 8: V+; PROD_ID: NA-XXXXX; VALUE: OP-AMP
IC11 = linear:78*: Positive VOLTAGE REGULATOR Source: http://cache.national.com/ds/LM/LM78L05.pdf http://www.fairchildsemi.com/ds/LM/LM7805.pdf
IC12-IC15 IC17-IC20 = SN74AUC2G66DCTR:SN74AUC2G66DCTR: Dual Bilateral Analog Switch Source: Datasheet <http://www.ti.com/lit/gpn/sn74auc2g66>; DESCRIPTION: Dual Bilateral Analog Switch; HEIGHT: 1.3mm; MANUFACTURER_NAME: Texas Instruments; MANUFACTURER_PART_NUMBER: SN74AUC2G66DCTR; MOUSER_PART_NUMBER: 595-SN74AUC2G66DCTR; MOUSER_PRICE-STOCK: https://www.mouser.co.uk/ProductDetail/Texas-Instruments/SN74AUC2G66DCTR?qs=X3IDIfI%252BJAXYLrXiJRkcqA%3D%3D
IC21-IC24 = 74AUP2GU04GW_125:74AUP2GU04GW,125: Inverters DUAL UNBUFF INVERTER 1.8V Source: Datasheet <https://componentsearchengine.com/Datasheets/1/74AUP2GU04GW,125.pdf>; DESCRIPTION: Inverters DUAL UNBUFF INVERTER 1.8V; HEIGHT: 1.1mm; MANUFACTURER_NAME: Nexperia; MANUFACTURER_PART_NUMBER: 74AUP2GU04GW,125; MOUSER_PART_NUMBER: 771-74AUP2GU04GW-G; MOUSER_PRICE-STOCK: https://www.mouser.com/Search/Refine.aspx?Keyword=771-74AUP2GU04GW-G
IC26 = burr-brown:REG1117: 800mA and 1A Low Dropout (LDO) Positive Regulator 1.8V, 2.5V, 2.85V, 3.3V, 5V, and Adj; JLC_ROTATION: 270; MPN: REG1117; OC_FARNELL: 1097566; OC_NEWARK: 14P6981
IO_C10 IO_H4 IO_H5 IO_H34 OPIN PULSESUMOUT = con-coax:BU-SMB-V: FEMALE SMB CONNECTOR Radiall distributor RS 112-2993; OC_FARNELL: unknown; OC_NEWARK: unknown
J1 J5 J9 = SparkFun-Connectors:CONN_08: Multi connection point. Often used as Generic Header-pin footprint for 0.1 inch spaced/style header connections On any of the 0.1 inch spaced packages, you can populate with these: Break Away Headers - Straight <https://www.sparkfun.com/products/116> (PRT-00116) Break Away Male Headers - Right Angle <https://www.sparkfun.com/products/553> (PRT-00553) Female Headers <https://www.sparkfun.com/products/115> (PRT-00115) Break Away Headers - Machine Pin <https://www.sparkfun.com/products/117> (PRT-00117) Break Away Female Headers - Swiss Machine Pin <https://www.sparkfun.com/products/743> (PRT-00743) Arduino Stackable Header - 8 Pin <https://www.sparkfun.com/products/9279> (PRT-09279) For SCREWTERMINALS and SPRING TERMINALS visit here: Screw Terimnals on SparkFun.com <https://www.sparkfun.com/search/results?term=Screw+Terminals> (5mm/3.5mm/2.54mm spacing) This device is also useful as a general connection point to wire up your design to another part of your project. Our various solder wires solder well into these plated through hole pads. Hook-Up Wire - Assortment (Stranded, 22 AWG) <https://www.sparkfun.com/products/11375> (PRT-11375) Hook-Up Wire - Assortment (Solid Core, 22 AWG) <https://www.sparkfun.com/products/11367> (PRT-11367) View the entire wire category on our website here <https://www.sparkfun.com/categories/141> Special notes: Molex polarized connector foot print use with SKU : PRT-08231 with associated crimp pins and housings. 1MM SMD Version SKU: PRT-10208 NOTES ON THE VARIANTS LOCK and LOCK_LONGPADS... This footprint was designed to help hold the alignment of a through-hole component (i.e. 6-pin header) while soldering it into place. You may notice that each hole has been shifted either up or down by 0.005 of an inch from it's more standard position (which is a perfectly straight line). This slight alteration caused the pins (the squares in the middle) to touch the edges of the holes. Because they are alternating, it causes a "brace" to hold the component in place. 0.005 has proven to be the perfect amount of "off-center" position when using our standard breakaway headers. Although looks a little odd when you look at the bare footprint, once you have a header in there, the alteration is very hard to notice. Also,if you push a header all the way into place, it is covered up entirely on the bottom side.; PROD_ID: CONN-08438
J2 = ASP-134604-01:ASP-134604-01: SAMTEC - ASP-134604-01 - Board-To-Board Connector, Vita 57 XMC, 1.27 mm, 160 Contacts, Header, ASP Series, Surface Mount Source: Datasheet <https://componentsearchengine.com/Datasheets/2/ASP-134604-01.pdf>; DESCRIPTION: SAMTEC - ASP-134604-01 - Board-To-Board Connector, Vita 57 XMC, 1.27 mm, 160 Contacts, Header, ASP Series, Surface Mount; HEIGHT: 7.11mm; MANUFACTURER_NAME: SAMTEC; MANUFACTURER_PART_NUMBER: ASP-134604-01; MOUSER_PART_NUMBER: 200-ASP-134604-01; MOUSER_PRICE-STOCK: https://www.mouser.co.uk/ProductDetail/Samtec/ASP-134604-01?qs=Rp%2FUEJiACm00i8g2mQ6XNw%3D%3D
J3 J4 J6-J8 J12 = Seeed-Connector:DIP-BLACK-FEMALE-HEADER-VERT(4P-2.54): 320030017; MPN: F185-1104A1BSYA1
L1 L2 = SparkFun-Passives:INDUCTOR: Inductors Basic Inductor/Choke - 0603 and 1206. Footprints are not proven and vary greatly between part numbers. INDUCTOR POWER 3.3UH 4.0A SMD 0.197" L x 0.197" W x 0.177" H (5.00mm x 5.00mm x 4.50mm)
R1-R3 R6-R14 R17-R85 = rcl:R-US_: RESISTOR, American symbol; SPICEPREFIX: R
R4 R5 R15 R16 = SparkFun-Resistors:RESISTOR: Resistor Basic schematic elements and footprints for 0603, 1206, and PTH resistors.
R_O2 R_VH R_VL = resistor:R-TRIMM: Trimm resistor
SV1 SV2 = con-lsta:FE20-1: FEMALE HEADER; OC_FARNELL: unknown; OC_NEWARK: unknown
U1 = Seeed-IC:LOGIC-TXS0108EPWR(TSSOP20): 310050026; MPN: TXS0108EPWR; VALUE: TXS0108EPWR-TSSOP20
U2 = STMicroelectronics - L7905ACV:STMICROELECTRONICS_L7905ACV: PM-REG-7905-SIL3; CIIVA_IDS: 1170788; COMPONENT_LINK_1_DESCRIPTION: Manufacturer URL; COMPONENT_LINK_1_URL: http://www.st.com; COMPONENT_LINK_3_DESCRIPTION: Package Specification; COMPONENT_LINK_3_URL: http://www.st.com/internet/com/TECHNICAL_RESOURCES/TECHNICAL_LITERATURE/PACKAGE_INFORMATION/CD00004649.pdf; DATASHEET: http://www.st.com/internet/com/TECHNICAL_RESOURCES/TECHNICAL_LITERATURE/DATASHEET/CD00000451.pdf; DATASHEET_VERSION: 1/11/2010; FOOTPRINT_VARIANT_NAME_0: Manufacturer Recommended; IMPORTED: yes; IMPORTED_FROM: vault; IMPORT_TS: 1521848450; MF: STMicroelectronics; MPN: L7905ACV; PACKAGE: TO220; PACKAGE_DESCRIPTION: TO, Thru-Hole, Vertical, Heatsink Mounted; 3 In-Line Leads; Pitch 2.54 mm; PACKAGE_VERSION: ver3.0; PREFIX: U; RELEASE_DATE: 1329864171; VAULT_GUID: 5B29AA1F-5F97-4F25-8065-F2268D85C1EF; VAULT_REVISION: 886B6513-4883-4FD4-B263-02E5612C6335

## Net classes
0 default: width 0.305 mm
1 power: width 0.406 mm
2 gnd: width 0.305 mm